# Altium project Anemoia-ESP32-SMD.PrjPcb (part 3 of 3)
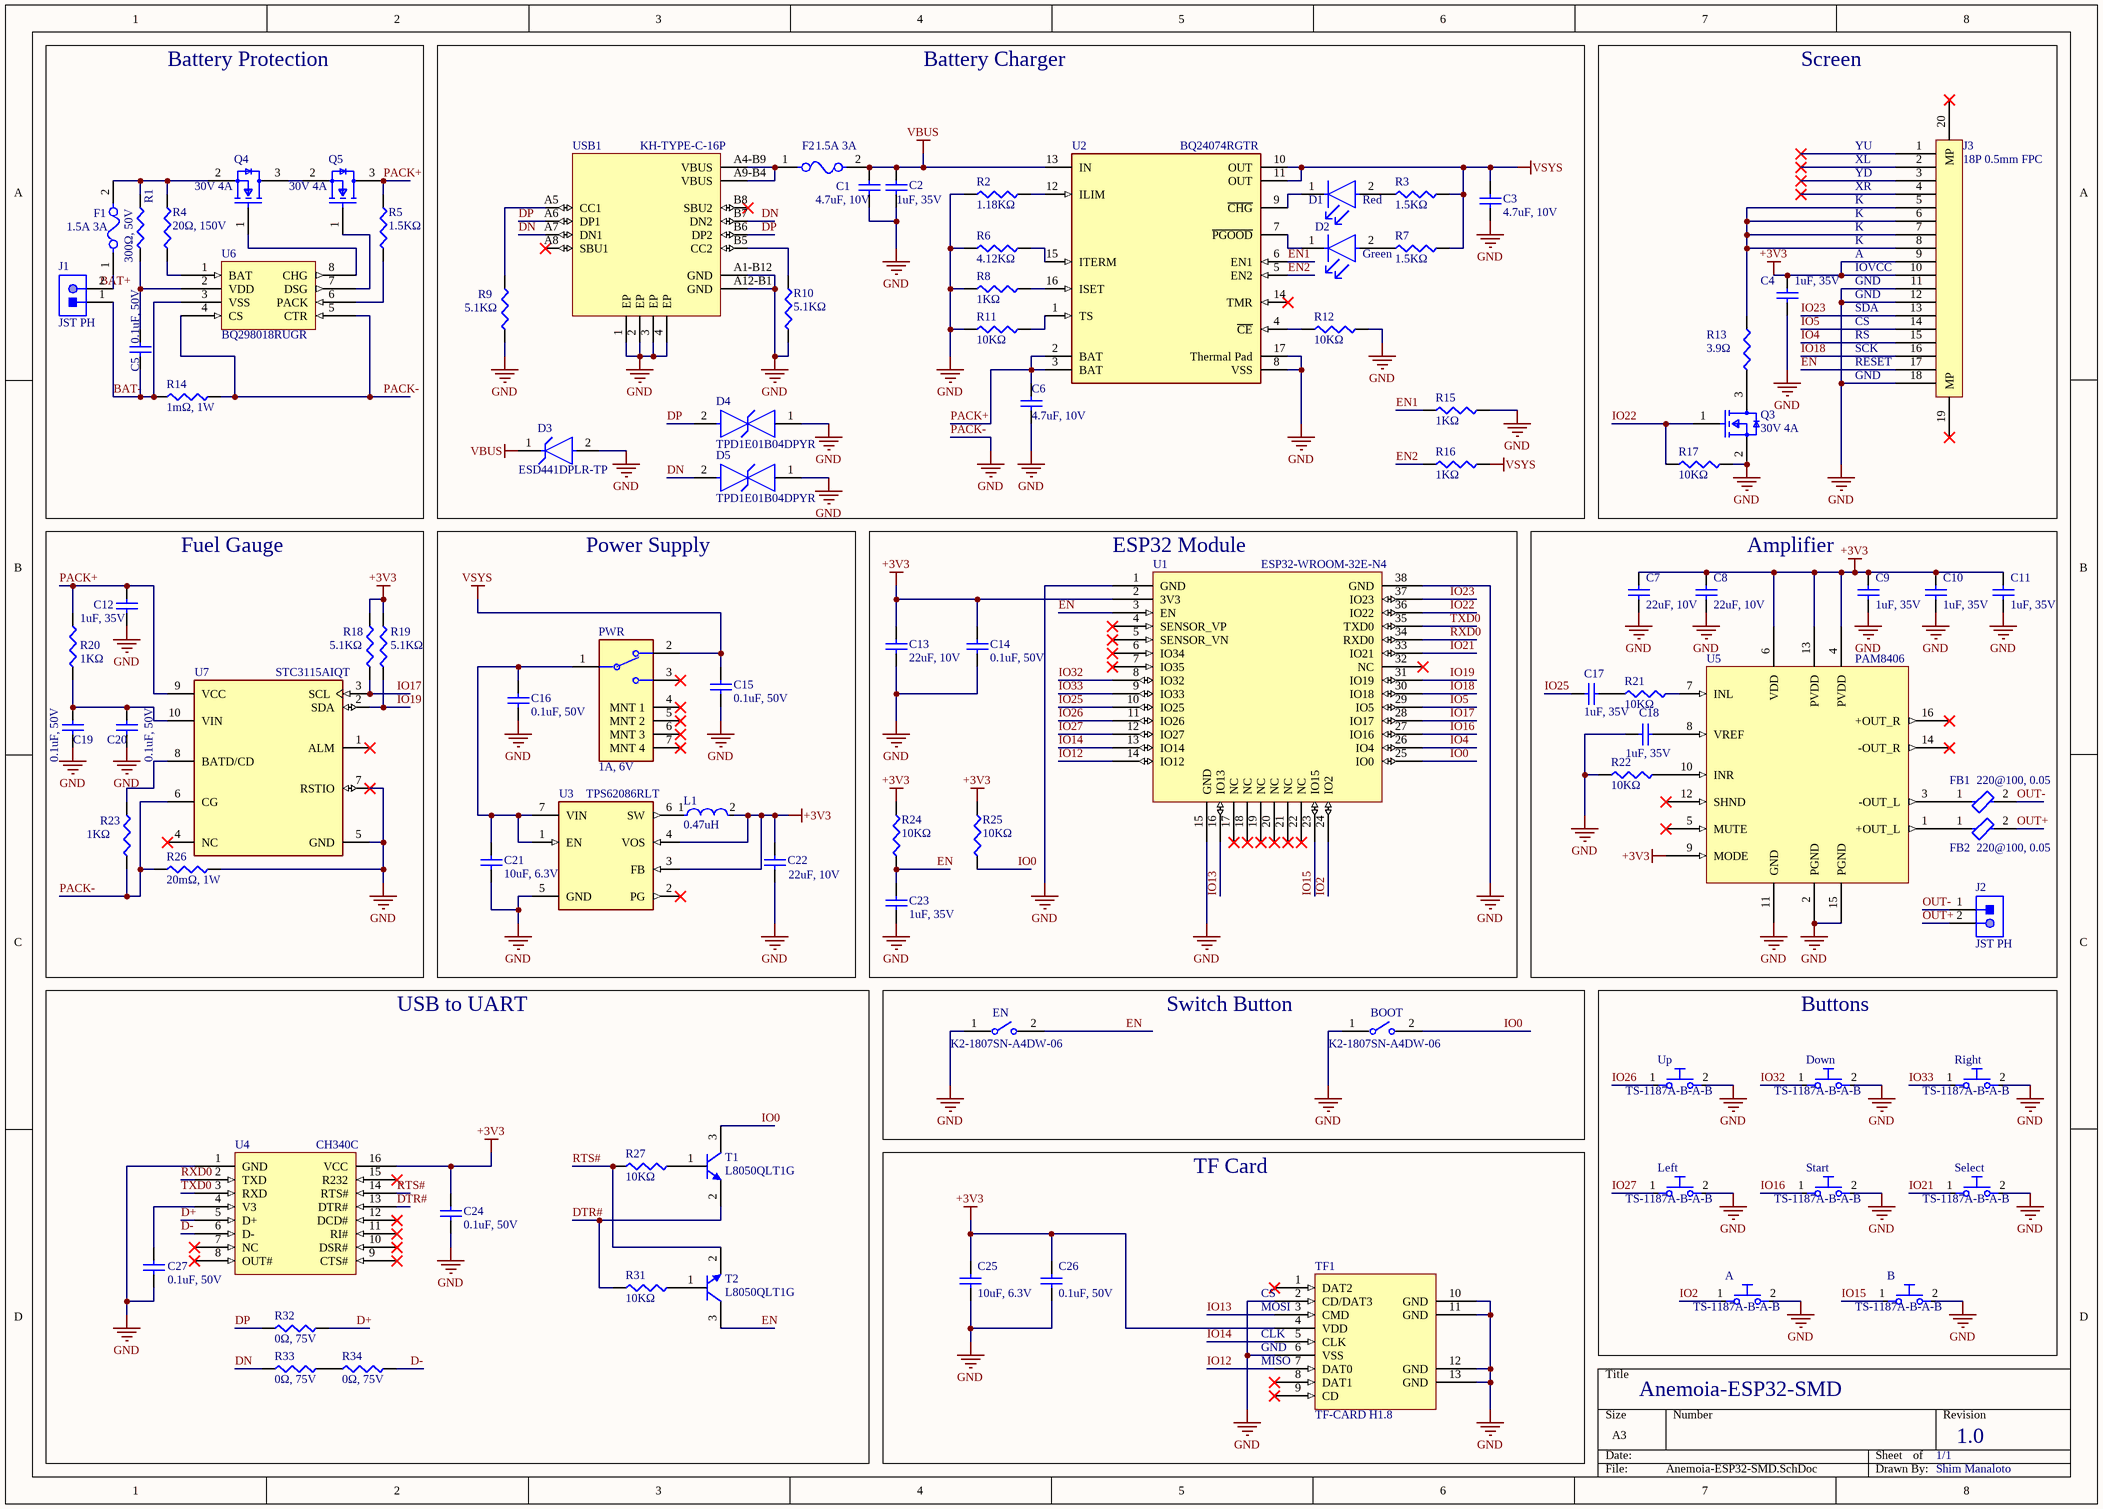
[diagram p2: Anemoia-ESP32-SMD.SchDoc]

## Sheet Anemoia-ESP32-SMD.SchDoc: Anemoia-ESP32 (continued)

### Library data of the parts (continued)
R11 R12 R17 R21 R22 R24 R25 R27 R31 = RC0402FR-0710KL: RES 10K OHM 1% 1/16W 0402; Manufacturer: Yageo Group; Power Dissipation: 62.5mW; Power Rating: 63mW; Temperature Coefficient: 100ppm/°C; Voltage Rating: 50V; Supplier 1: DigiKey; Manufacturer Part Number: RC0402FR-0710KL; RoHS: Compliant; Category: Chip SMD Resistors; Stock 1: 8175534; Case/Package: 0402; Case Code (Imperial): 0402; Case Code (Metric): 0402; China RoHS: Non-Compliant; Composition: Thick Film; Depth: 500µm; Height: 350µm; Lead Free: Lead Free; Lead Pitch: 200µm; Length: 1mm; Lifecycle Status: Production; Max Operating Temperature: 155°C; Military Standard: Not; Min Operating Temperature: -55°C; Mount: Surface Mount; Number of Pins: 2; Number of Terminals: 2; Number of Terminations: 2; Packaging: Tape & Reel; REACH SVHC: Yes; Resistance: 10kΩ; Schedule B: 8533210045, 8533210045|8533210045|8533210045|8533210045|8533210045|8533210045|8533210045|8533210045|8533210045|8533210045|8533210045|8533210045|8533210045|8533210045, 8533210045|8533210045|8533210045|8533210045|8533210045|8533210045|8533210045|8533210045|8533210045|8533210045|8533210045|8533210045|8533210045|8533210045|8533210045, 8533210045|8533210045|8533210045|8533210045|8533210045|8533210045|8533210045|8533210045|8533210045|8533210045|8533210045|8533210045|8533210045|8533210045|8533210045|8533210045; Termination: SMD/SMT; Tolerance: 1%; Voltage Rating (DC): 50V; Width: 500µm; Working Voltage: 50V; ComponentLink1URL: https://datasheet.octopart.com:443/RC0402FR-0710KL-Yageo-datasheet-175887523.pdf?src-supplier=Newark; ComponentLink1Description: https://datasheet.octopart.com:443/RC0402FR-0710KL-Yageo-datasheet-175887523.pdf?src-supplier=Newark; ComponentLink2URL: https://datasheet.octopart.com:443/RC0402FR-0710KL-Yageo-datasheet-12531192.pdf?src-supplier=Newark; ComponentLink2Description: https://datasheet.octopart.com:443/RC0402FR-0710KL-Yageo-datasheet-12531192.pdf?src-supplier=Newark; ComponentLink3URL: https://datasheet.octopart.com:443/RC0402FR-0710KL-Yageo-datasheet-8324527.pdf?src-supplier=Newark; ComponentLink3Description: https://datasheet.octopart.com:443/RC0402FR-0710KL-Yageo-datasheet-8324527.pdf?src-supplier=Newark; ComponentLink4URL: https://datasheet.octopart.com:443/RC0402FR-0710KL-Yageo-datasheet-10408619.pdf?src-supplier=element14+APAC; ComponentLink4Description: https://datasheet.octopart.com:443/RC0402FR-0710KL-Yageo-datasheet-10408619.pdf?src-supplier=element14+APAC; ComponentLink5URL: https://datasheet.octopart.com:443/RC0402FR-0710KL-Yageo-datasheet-62067350.pdf?src-supplier=element14+APAC; ComponentLink5Description: https://datasheet.octopart.com:443/RC0402FR-0710KL-Yageo-datasheet-62067350.pdf?src-supplier=element14+APAC; ComponentLink6URL: https://datasheet.octopart.com:443/RC0402FR-0710KL-Yageo-datasheet-21426659.pdf?src-supplier=element14+APAC; ComponentLink6Description: https://datasheet.octopart.com:443/RC0402FR-0710KL-Yageo-datasheet-21426659.pdf?src-supplier=element14+APAC; ComponentLink7URL: https://datasheet.octopart.com:443/RC0402FR-0710KL-Yageo-datasheet-164759695.pdf?src-supplier=Upverter; ComponentLink7Description: https://datasheet.octopart.com:443/RC0402FR-0710KL-Yageo-datasheet-164759695.pdf?src-supplier=Upverter; ComponentLink8URL: https://datasheet.octopart.com:443/RC0402FR-0710KL-Yageo-datasheet-103092701.pdf?src-supplier=Upverter; ComponentLink8Description: https://datasheet.octopart.com:443/RC0402FR-0710KL-Yageo-datasheet-103092701.pdf?src-supplier=Upverter; ComponentLink9URL: https://sigma.octopart.com:443/138820526/technical_drawing/Yageo-RC0402FR-0710KL.pdf?src-supplier=Upverter; ComponentLink9Description: https://sigma.octopart.com:443/138820526/technical_drawing/Yageo-RC0402FR-0710KL.pdf?src-supplier=Upverter; ComponentLink10URL: https://datasheet.octopart.com:443/RC0402FR-0710KL-Yageo-datasheet-98239111.pdf?src-supplier=Upverter; ComponentLink10Description: https://datasheet.octopart.com:443/RC0402FR-0710KL-Yageo-datasheet-98239111.pdf?src-supplier=Upverter; ComponentLink11URL: https://datasheet.octopart.com:443/RC0402FR-0710KL-Yageo-datasheet-68298067.pdf?src-supplier=Upverter; ComponentLink11Description: https://datasheet.octopart.com:443/RC0402FR-0710KL-Yageo-datasheet-68298067.pdf?src-supplier=Upverter; ComponentLink12URL: https://datasheet.octopart.com:443/RC0402FR-0710KL-Yageo-datasheet-68297981.pdf?src-supplier=Upverter; ComponentLink12Description: https://datasheet.octopart.com:443/RC0402FR-0710KL-Yageo-datasheet-68297981.pdf?src-supplier=Upverter; ComponentLink13URL: https://datasheet.octopart.com:443/RC0402FR-0710KL-Yageo-datasheet-141435361.pdf?src-supplier=Upverter; ComponentLink13Description: https://datasheet.octopart.com:443/RC0402FR-0710KL-Yageo-datasheet-141435361.pdf?src-supplier=Upverter; ComponentLink14URL: https://datasheet.octopart.com:443/RC0402FR-0710KL-Yageo-datasheet-12509768.pdf?src-supplier=Upverter; ComponentLink14Description: https://datasheet.octopart.com:443/RC0402FR-0710KL-Yageo-datasheet-12509768.pdf?src-supplier=Upverter; ComponentLink15URL: https://datasheet.octopart.com:443/RC0402FR-0710KL-Yageo-datasheet-8329306.pdf?src-supplier=element14; ComponentLink15Description: https://datasheet.octopart.com:443/RC0402FR-0710KL-Yageo-datasheet-8329306.pdf?src-supplier=element14; ComponentLink16URL: https://datasheet.octopart.com:443/RC0402FR-0710KL-Yageo-datasheet-505231.pdf?src-supplier=element14; ComponentLink16Description: https://datasheet.octopart.com:443/RC0402FR-0710KL-Yageo-datasheet-505231.pdf?src-supplier=element14; ComponentLink17URL: https://datasheet.octopart.com:443/RC0402FR-0710KL-Yageo-datasheet-175423674.pdf?src-supplier=SOS+electronic; ComponentLink17Description: https://datasheet.octopart.com:443/RC0402FR-0710KL-Yageo-datasheet-175423674.pdf?src-supplier=SOS+electronic; ComponentLink18URL: https://datasheet.octopart.com:443/RC0402FR-0710KL-Yageo-datasheet-137700087.pdf?src-supplier=Future+Electronics; ComponentLink18Description: https://datasheet.octopart.com:443/RC0402FR-0710KL-Yageo-datasheet-137700087.pdf?src-supplier=Future+Electronics; ComponentLink19URL: https://datasheet.octopart.com:443/RC0402FR-0710KL-Yageo-datasheet-8324255.pdf?src-supplier=Future+Electronics; ComponentLink19Description: https://datasheet.octopart.com:443/RC0402FR-0710KL-Yageo-datasheet-8324255.pdf?src-supplier=Future+Electronics; ComponentLink20URL: https://datasheet.octopart.com:443/RC0402FR-0710KL-Yageo-datasheet-79472498.pdf?src-supplier=Megastar; ComponentLink20Description: https://datasheet.octopart.com:443/RC0402FR-0710KL-Yageo-datasheet-79472498.pdf?src-supplier=Megastar; ComponentLink21URL: https://datasheet.octopart.com/RC0402FR-0710KL-Yageo-datasheet-73766026.pdf; ComponentLink21Description: https://datasheet.octopart.com/RC0402FR-0710KL-Yageo-datasheet-73766026.pdf; ComponentLink22URL: http://sigma.octopart.com:80/conflict_mineral_statement/Yageo-company-3.pdf?src-supplier=Compliance+Statements; ComponentLink22Description: http://sigma.octopart.com:80/conflict_mineral_statement/Yageo-company-3.pdf?src-supplier=Compliance+Statements; ComponentLink23URL: http://sigma.octopart.com:80/rohs_statement/Yageo-company-2.pdf?src-supplier=Compliance+Statements; ComponentLink23Description: http://sigma.octopart.com:80/rohs_statement/Yageo-company-2.pdf?src-supplier=Compliance+Statements
R13 = LTR18EZPJ3R9: RES 3.9Ω ±5% 750mW 0612; Manufacturer: ROHM; Temperature Coefficient: 200ppm/°C; Voltage Rating: 200V; Supplier 1: Mouser; Manufacturer Part Number: LTR18EZPJ3R9; RoHS: Compliant; Category: Chip SMD Resistors; Stock 1: 4914; Case/Package: 0612; Composition: Thick Film; Height: 550µm; Lifecycle Status: Production; Max Operating Temperature: 155°C; Min Operating Temperature: -55°C; Mount: Surface Mount; Number of Terminals: 2; Power Dissipation: 750mW; Power Rating: 750mW; REACH SVHC: Yes; Resistance: 3.9Ω; Tolerance: 5%; Width: 1.6mm; Working Voltage: 200V; ComponentLink1URL: https://datasheet.octopart.com:443/LTR18EZPJ3R9-ROHM-datasheet-168137580.pdf?src-supplier=IHS; ComponentLink1Description: https://datasheet.octopart.com:443/LTR18EZPJ3R9-ROHM-datasheet-168137580.pdf?src-supplier=IHS
R14 = FRM121WFR001TM: RES 1mΩ ±1% 1W 1206
R26 = FRM121WFR020TM: RES 20mΩ ±1% 1W 1206
R32-R34 = RC0603FR-070RL: RES 0Ω ±1% 100mW 0603; Manufacturer: Yageo Group; Current Rating: 1A; Temperature Coefficient: 200ppm/°C; Voltage Rating (DC): 50V; Supplier 1: Avnet; Manufacturer Part Number: RC0603FR-070RL; RoHS: Compliant; Category: Chip SMD Resistors; Stock 1: 124388; Case/Package: 0603; Case Code (Imperial): 0603; China RoHS: Non-Compliant; Composition: Thick Film; Contact Plating: Tin; Depth: 800µm; Features: Moisture Resistant; Height: 450µm; Lead Free: Lead Free; Length: 1.6mm; Lifecycle Status: Production; Max Operating Temperature: 155°C; Max Power Dissipation: 100mW; Military Standard: Not; Min Operating Temperature: -55°C; Mount: Surface Mount; Number of Pins: 2; Number of Terminals: 2; Number of Terminations: 2; Packaging: Tape & Reel; Power Dissipation: 100mW; Power Rating: 100mW; Radiation Hardening: No; REACH SVHC: Yes; Resistance: 0Ω; Schedule B: 8533210045, 8533210045|8533210045|8533210045|8533210045|8533210045; Termination: SMD/SMT; Tolerance: 1%; Voltage Rating: 75V; Width: 800µm; Working Voltage: 75V; ComponentLink1URL: https://datasheet.octopart.com:443/RC0603FR-070RL-Yageo-datasheet-127823281.pdf?src-supplier=Upverter; ComponentLink1Description: https://datasheet.octopart.com:443/RC0603FR-070RL-Yageo-datasheet-127823281.pdf?src-supplier=Upverter; ComponentLink2URL: https://datasheet.octopart.com:443/RC0603FR-070RL-Yageo-datasheet-30459151.pdf?src-supplier=IHS; ComponentLink2Description: https://datasheet.octopart.com:443/RC0603FR-070RL-Yageo-datasheet-30459151.pdf?src-supplier=IHS; ComponentLink3URL: https://datasheet.octopart.com:443/RC0603FR-070RL-Yageo-datasheet-8328172.pdf?src-supplier=element14+APAC; ComponentLink3Description: https://datasheet.octopart.com:443/RC0603FR-070RL-Yageo-datasheet-8328172.pdf?src-supplier=element14+APAC; ComponentLink4URL: https://datasheet.octopart.com:443/RC0603FR-070RL-Yageo-datasheet-34211833.pdf?src-supplier=Newark; ComponentLink4Description: https://datasheet.octopart.com:443/RC0603FR-070RL-Yageo-datasheet-34211833.pdf?src-supplier=Newark; ComponentLink5URL: https://datasheet.octopart.com:443/RC0603FR-070RL-Yageo-datasheet-164759695.pdf?src-supplier=Future+Electronics; ComponentLink5Description: https://datasheet.octopart.com:443/RC0603FR-070RL-Yageo-datasheet-164759695.pdf?src-supplier=Future+Electronics; ComponentLink6URL: https://datasheet.octopart.com:443/RC0603FR-070RL-Yageo-datasheet-137700087.pdf?src-supplier=Future+Electronics; ComponentLink6Description: https://datasheet.octopart.com:443/RC0603FR-070RL-Yageo-datasheet-137700087.pdf?src-supplier=Future+Electronics; ComponentLink7URL: https://datasheet.octopart.com:443/RC0603FR-070RL-Yageo-datasheet-15599030.pdf?src-supplier=Future+Electronics; ComponentLink7Description: https://datasheet.octopart.com:443/RC0603FR-070RL-Yageo-datasheet-15599030.pdf?src-supplier=Future+Electronics; ComponentLink8URL: https://datasheet.octopart.com:443/RC0603FR-070RL-Yageo-datasheet-12596169.pdf?src-supplier=Future+Electronics; ComponentLink8Description: https://datasheet.octopart.com:443/RC0603FR-070RL-Yageo-datasheet-12596169.pdf?src-supplier=Future+Electronics; ComponentLink9URL: https://datasheet.octopart.com/RC0603FR-070RL-Yageo-datasheet-73766026.pdf; ComponentLink9Description: https://datasheet.octopart.com/RC0603FR-070RL-Yageo-datasheet-73766026.pdf; ComponentLink10URL: http://sigma.octopart.com:80/conflict_mineral_statement/Yageo-company-3.pdf?src-supplier=Compliance+Statements; ComponentLink10Description: http://sigma.octopart.com:80/conflict_mineral_statement/Yageo-company-3.pdf?src-supplier=Compliance+Statements; ComponentLink11URL: http://sigma.octopart.com:80/rohs_statement/Yageo-company-2.pdf?src-supplier=Compliance+Statements; ComponentLink11Description: http://sigma.octopart.com:80/rohs_statement/Yageo-company-2.pdf?src-supplier=Compliance+Statements
T1 T2 = L8050QLT1G: TRANS NPN 25V 800mA SOT-23
TF1 = TF-CARD H1.8: Push-Push 1.8mm MicroSD Card (TF Card) SMD PC Card Sockets RoHS
U1 = ESP32-WROOM-32E-N4: WLAN+BT Module 2412MHz to 2484MHz 47-Pin SMD Module; Manufacturer: Espressif Systems; Max Supply Voltage: 3.6V; Min Supply Voltage: 3V; Operating Supply Voltage: 3.3V; Supplier 1: DigiKey; Manufacturer Part Number: ESP32-WROOM-32E-N4; RoHS: Compliant; Category: RF Transceiver Modules and Modems; Stock 1: 14375; Height - Seated (Max): 3.25mm; Length: 25.5mm; Max Operating Temperature: 85°C; Min Operating Temperature: -40°C; Number of Terminals: 38; Terminal Pitch: 1.27mm; Width: 18mm; ComponentLink1URL: https://datasheet.octopart.com:443/ESP32-WROOM-32E-N4-Espressif-Systems-datasheet-182247776.pdf?src-supplier=IHS; ComponentLink1Description: https://datasheet.octopart.com:443/ESP32-WROOM-32E-N4-Espressif-Systems-datasheet-182247776.pdf?src-supplier=IHS; ComponentLink2URL: https://datasheet.octopart.com:443/ESP32-WROOM-32E-N4-Espressif-Systems-datasheet-188867343.pdf?src-supplier=TME; ComponentLink2Description: https://datasheet.octopart.com:443/ESP32-WROOM-32E-N4-Espressif-Systems-datasheet-188867343.pdf?src-supplier=TME; ComponentLink3URL: https://datasheet.octopart.com:443/ESP32-WROOM-32E-N4-Espressif-Systems-datasheet-165560559.pdf?src-supplier=TME; ComponentLink3Description: https://datasheet.octopart.com:443/ESP32-WROOM-32E-N4-Espressif-Systems-datasheet-165560559.pdf?src-supplier=TME; ComponentLink4URL: https://datasheet.octopart.com:443/ESP32-WROOM-32E-N4-Espressif-Systems-datasheet-151884363.pdf?src-supplier=Future+Electronics; ComponentLink4Description: https://datasheet.octopart.com:443/ESP32-WROOM-32E-N4-Espressif-Systems-datasheet-151884363.pdf?src-supplier=Future+Electronics; Supplier Part Number 1: 1965-ESP32-WROOM-32E-N4CT-ND
U2 = BQ24074RGTR: IC BATT CHG LI-ION 1CELL 16QFN; Manufacturer: Texas Instruments; Manufacturer Lifecycle Status: ACTIVE; Battery Pack Voltage: 4.2V; Fault Protection: Over Temperature, Over Voltage, Reverse Current, Short Circuit; Interface: USB; Max Charge Current: 1.5A; Max Junction Temperature (Tj): 125°C; Max Supply Voltage: 26V; Min Input Voltage: 4.3V; Min Supply Voltage: 4.35V; Nominal Input Voltage: 10.2V; Nominal Supply Current: 1.5mA; Number of Cells: 1; Output Current: 4.5A; Output Voltage: 4.4V; Supplier 1: DigiKey; Manufacturer Part Number: BQ24074RGTR; RoHS: Compliant; Category: Battery Management; Stock 1: 11549; Case/Package: VQFN; Contact Plating: Gold; Height: 1mm; Lead Free: Lead Free; Length: 3mm; Lifecycle Status: Production; Max Operating Temperature: 85°C; Min Operating Temperature: -40°C; Number of Outputs: 1; Number of Pins: 16; Radiation Hardening: No; Schedule B: 8542390000, 8542390000|8542390000|8542390000|8542390000|8542390000; Thickness: 900µm; Weight: 22.906415mg; Width: 3mm; ComponentLink1URL: https://sigma.octopart.com:443/68310154/technical_drawing/Texas-Instruments-BQ24074RGTR.pdf?src-supplier=Texas+Instruments; ComponentLink1Description: https://sigma.octopart.com:443/68310154/technical_drawing/Texas-Instruments-BQ24074RGTR.pdf?src-supplier=Texas+Instruments; ComponentLink2URL: https://octopart.com:443/opatz8j6/c1?t=LI6ofj69sjsi_xI-KCRS32YmFkc6PT_npiBGUljbX42Z0BJJByqH_j_BDc6kYD6Eat0jCYrMh4TufOjWAhSEeoHRaPevcbfoTFbNgKFqKFSJyet90_ee_lMlYjJX60zLOSdH2MDfXXxrbeY54JkgwoMaRii8bRM8dy3Hup1_4k0sdOE1ly5WLodxihE6XQQf4-0AX14FQY1Zpi93zFashd_QXSp6UW_oM1D47aC421vpmwU9JfP_2WyTHqXyLnxVXQKU6NISI5jvI_zXQBp__czZR7PxssDrGT_L0sVVqAlxkZPKysANPn2yYv6hgsyRXqVf_F6izNr7U4_rFkcyJWP_9JNu77IKMtSnY067jtJjumLI24vxgswM5n7dL12CtrIuz8I&src-supplier=Texas+Instruments; ComponentLink2Description: https://octopart.com:443/opatz8j6/c1?t=LI6ofj69sjsi_xI-KCRS32YmFkc6PT_npiBGUljbX42Z0BJJByqH_j_BDc6kYD6Eat0jCYrMh4TufOjWAhSEeoHRaPevcbfoTFbNgKFqKFSJyet90_ee_lMlYjJX60zLOSdH2MDfXXxrbeY54JkgwoMaRii8bRM8dy3Hup1_4k0sdOE1ly5WLodxihE6XQQf4-0AX14FQY1Zpi93zFashd_QXSp6UW_oM1D47aC421vpmwU9JfP_2WyTHqXyLnxVXQKU6NISI5jvI_zXQBp__czZR7PxssDrGT_L0sVVqAlxkZPKysANPn2yYv6hgsyRXqVf_F6izNr7U4_rFkcyJWP_9JNu77IKMtSnY067jtJjumLI24vxgswM5n7dL12CtrIuz8I&src-supplier=Texas+Instruments; ComponentLink3URL: https://datasheet.octopart.com:443/BQ24074RGTR-Texas-Instruments-datasheet-38229648.pdf?src-supplier=Texas+Instruments; ComponentLink3Description: https://datasheet.octopart.com:443/BQ24074RGTR-Texas-Instruments-datasheet-38229648.pdf?src-supplier=Texas+Instruments; ComponentLink4URL: https://datasheet.octopart.com:443/BQ24074RGTR-Texas-Instruments-datasheet-37101711.pdf?src-supplier=Texas+Instruments; ComponentLink4Description: https://datasheet.octopart.com:443/BQ24074RGTR-Texas-Instruments-datasheet-37101711.pdf?src-supplier=Texas+Instruments; ComponentLink5URL: https://datasheet.octopart.com:443/BQ24074RGTR-Texas-Instruments-datasheet-21772815.pdf?src-supplier=Texas+Instruments; ComponentLink5Description: https://datasheet.octopart.com:443/BQ24074RGTR-Texas-Instruments-datasheet-21772815.pdf?src-supplier=Texas+Instruments; ComponentLink6URL: https://sigma.octopart.com:443/49250272/technical_drawing/Texas-Instruments-BQ24074RGTR.pdf?src-supplier=Texas+Instruments; ComponentLink6Description: https://sigma.octopart.com:443/49250272/technical_drawing/Texas-Instruments-BQ24074RGTR.pdf?src-supplier=Texas+Instruments; ComponentLink7URL: https://datasheet.octopart.com:443/BQ24074RGTR-Texas-Instruments-datasheet-10284113.pdf?src-supplier=Texas+Instruments; ComponentLink7Description: https://datasheet.octopart.com:443/BQ24074RGTR-Texas-Instruments-datasheet-10284113.pdf?src-supplier=Texas+Instruments; ComponentLink8URL: https://datasheet.octopart.com:443/BQ24074RGTR-Texas-Instruments-datasheet-10253851.pdf?src-supplier=Texas+Instruments; ComponentLink8Description: https://datasheet.octopart.com:443/BQ24074RGTR-Texas-Instruments-datasheet-10253851.pdf?src-supplier=Texas+Instruments; ComponentLink9URL: https://datasheet.octopart.com:443/BQ24074RGTR-Texas-Instruments-datasheet-16079513.pdf?src-supplier=Newark; ComponentLink9Description: https://datasheet.octopart.com:443/BQ24074RGTR-Texas-Instruments-datasheet-16079513.pdf?src-supplier=Newark; ComponentLink10URL: https://datasheet.octopart.com:443/BQ24074RGTR-Texas-Instruments-datasheet-165803752.pdf?src-supplier=LCSC; ComponentLink10Description: https://datasheet.octopart.com:443/BQ24074RGTR-Texas-Instruments-datasheet-165803752.pdf?src-supplier=LCSC; ComponentLink11URL: https://datasheet.octopart.com:443/BQ24074RGTR-Texas-Instruments-datasheet-163726753.pdf?src-supplier=LCSC; ComponentLink11Description: https://datasheet.octopart.com:443/BQ24074RGTR-Texas-Instruments-datasheet-163726753.pdf?src-supplier=LCSC; ComponentLink12URL: https://datasheet.octopart.com:443/BQ24074RGTR-Texas-Instruments-datasheet-164412844.pdf?src-supplier=SHENGYU+ELECTRONICS; ComponentLink12Description: https://datasheet.octopart.com:443/BQ24074RGTR-Texas-Instruments-datasheet-164412844.pdf?src-supplier=SHENGYU+ELECTRONICS; ComponentLink13URL: https://datasheet.octopart.com:443/BQ24074RGTR-Texas-Instruments-datasheet-14154534.pdf?src-supplier=iiiC; ComponentLink13Description: https://datasheet.octopart.com:443/BQ24074RGTR-Texas-Instruments-datasheet-14154534.pdf?src-supplier=iiiC; ComponentLink14URL: http://sigma.octopart.com:80/conflict_mineral_statement/Texas-Instruments-company-63.pdf?src-supplier=Compliance+Statements; ComponentLink14Description: http://sigma.octopart.com:80/conflict_mineral_statement/Texas-Instruments-company-63.pdf?src-supplier=Compliance+Statements; ComponentLink15URL: http://sigma.octopart.com:80/reach_statement/Texas-Instruments-company-64.pdf?src-supplier=Compliance+Statements; ComponentLink15Description: http://sigma.octopart.com:80/reach_statement/Texas-Instruments-company-64.pdf?src-supplier=Compliance+Statements
U3 = TPS62086RLTR: 2.4MHz Buck 3A Fixed 3.3V 1 VSON-7(2x2) Voltage Regulators - DC DC Switching Regulators RoHS; Manufacturer: Texas Instruments; Manufacturer Lifecycle Status: ACTIVE; Efficiency: 95%; Max Duty Cycle: 100%; Max Input Voltage: 6V; Max Junction Temperature (Tj): 125°C; Min Input Voltage: 2.5V; Nominal Supply Current: 17µA; Number of Outputs: 1; Output Configuration: Positive; Synchronous Rectifier: Yes; Supplier 1: DigiKey; Manufacturer Part Number: TPS62086RLTR; RoHS: Compliant; Category: Voltage Regulators - Switching; Stock 1: 149; Case/Package: VQFN; Height: 1mm; Lead Free: Lead Free; Length: 2mm; Lifecycle Status: Production; Max Operating Temperature: 125°C; Max Output Current: 3A; Max Supply Voltage: 6V; Min Operating Temperature: -40°C; Min Output Voltage: 3.3V; Min Supply Voltage: 2.5V; Mount: Surface Mount; Number of Pins: 7; Operating Supply Voltage: 6V; Output Current: 3A; Output Type: Fixed; Output Voltage: 3.3V; Packaging: Tape & Reel (TR); Radiation Hardening: No; Schedule B: 8542390000, 8542390000|8542390000|8542390000|8542390000|8542390000; Switching Frequency: 2.4MHz; Thickness: 900µm; Topology: Buck; Width: 2mm; ComponentLink1URL: https://octopart.com:443/opatz8j6/c1?t=zLf386fj0ibO5NaoSy2k8jd9nPNwEci5YYQicrbra0aFWFytLsUdbb0hTUDDaANyQQwBDYr7V3QKionmdZsJJXUYtB0NJgYjWz6oQuqaUgS5j9X-IyE01ALEJilTv_Q5C8KDVlxq14opzcnp7e_8Z4Mt-FTf3BrnMs1wWLAliJmyVZc25-BOlLyFKzDSwYyB2OqCuUck4xbtoc4mzyJqMrEioRwdgPXnEEA5Fpne0hjuF2kVbuuQmyzQeTHLPqQbzh6zJgaGUw7h6LtPvYTOUam0V6jMwSPu6xRcMnLbqQAHLiEwM3xTlXESrJQ9Z8a77dbxqkQD7BdH-9uuMFmviXkyeikfzgO4zKLpPyqxQRTxO0Tumvj-BoCeSJR17CuUm98-PX99&src-supplier=Texas+Instruments; ComponentLink1Description: https://octopart.com:443/opatz8j6/c1?t=zLf386fj0ibO5NaoSy2k8jd9nPNwEci5YYQicrbra0aFWFytLsUdbb0hTUDDaANyQQwBDYr7V3QKionmdZsJJXUYtB0NJgYjWz6oQuqaUgS5j9X-IyE01ALEJilTv_Q5C8KDVlxq14opzcnp7e_8Z4Mt-FTf3BrnMs1wWLAliJmyVZc25-BOlLyFKzDSwYyB2OqCuUck4xbtoc4mzyJqMrEioRwdgPXnEEA5Fpne0hjuF2kVbuuQmyzQeTHLPqQbzh6zJgaGUw7h6LtPvYTOUam0V6jMwSPu6xRcMnLbqQAHLiEwM3xTlXESrJQ9Z8a77dbxqkQD7BdH-9uuMFmviXkyeikfzgO4zKLpPyqxQRTxO0Tumvj-BoCeSJR17CuUm98-PX99&src-supplier=Texas+Instruments; ComponentLink2URL: https://sigma.octopart.com:443/62099402/technical_drawing/Texas-Instruments-TPS62086RLTR.pdf?src-supplier=Texas+Instruments; ComponentLink2Description: https://sigma.octopart.com:443/62099402/technical_drawing/Texas-Instruments-TPS62086RLTR.pdf?src-supplier=Texas+Instruments; ComponentLink3URL: https://datasheet.octopart.com:443/TPS62086RLTR-Texas-Instruments-datasheet-41218635.pdf?src-supplier=Texas+Instruments; ComponentLink3Description: https://datasheet.octopart.com:443/TPS62086RLTR-Texas-Instruments-datasheet-41218635.pdf?src-supplier=Texas+Instruments; ComponentLink4URL: https://sigma.octopart.com:443/49261848/technical_drawing/Texas-Instruments-TPS62086RLTR.pdf?src-supplier=Texas+Instruments; ComponentLink4Description: https://sigma.octopart.com:443/49261848/technical_drawing/Texas-Instruments-TPS62086RLTR.pdf?src-supplier=Texas+Instruments; ComponentLink5URL: https://datasheet.octopart.com:443/TPS62086RLTR-Texas-Instruments-datasheet-21096292.pdf?src-supplier=Texas+Instruments; ComponentLink5Description: https://datasheet.octopart.com:443/TPS62086RLTR-Texas-Instruments-datasheet-21096292.pdf?src-supplier=Texas+Instruments; ComponentLink6URL: https://datasheet.octopart.com:443/TPS62086RLTR-Texas-Instruments-datasheet-148807817.pdf?src-supplier=Upverter; ComponentLink6Description: https://datasheet.octopart.com:443/TPS62086RLTR-Texas-Instruments-datasheet-148807817.pdf?src-supplier=Upverter; ComponentLink7URL: https://datasheet.octopart.com:443/TPS62086RLTR-Texas-Instruments-datasheet-165804823.pdf?src-supplier=LCSC; ComponentLink7Description: https://datasheet.octopart.com:443/TPS62086RLTR-Texas-Instruments-datasheet-165804823.pdf?src-supplier=LCSC; ComponentLink8URL: https://datasheet.octopart.com:443/TPS62086RLTR-Texas-Instruments-datasheet-159118203.pdf?src-supplier=LCSC; ComponentLink8Description: https://datasheet.octopart.com:443/TPS62086RLTR-Texas-Instruments-datasheet-159118203.pdf?src-supplier=LCSC; ComponentLink9URL: https://datasheet.octopart.com:443/TPS62086RLTR-Texas-Instruments-datasheet-140571925.pdf?src-supplier=Arrow.cn; ComponentLink9Description: https://datasheet.octopart.com:443/TPS62086RLTR-Texas-Instruments-datasheet-140571925.pdf?src-supplier=Arrow.cn; ComponentLink10URL: http://sigma.octopart.com:80/conflict_mineral_statement/Texas-Instruments-company-63.pdf?src-supplier=Compliance+Statements; ComponentLink10Description: http://sigma.octopart.com:80/conflict_mineral_statement/Texas-Instruments-company-63.pdf?src-supplier=Compliance+Statements; ComponentLink11URL: http://sigma.octopart.com:80/reach_statement/Texas-Instruments-company-64.pdf?src-supplier=Compliance+Statements; ComponentLink11Description: http://sigma.octopart.com:80/reach_statement/Texas-Instruments-company-64.pdf?src-supplier=Compliance+Statements
U4 = CH340C: USB to Serial Port chip
U5 = PAM8406: 5W Stereo Audio Amplifier
U6 = BQ298018RUGR: High-side protector for single-cell li-ion and li-polymer batteries 8-X2QFN -40 to 85; Manufacturer: Texas Instruments; Manufacturer Lifecycle Status: ACTIVE; Supplier 1: DigiKey; Manufacturer Part Number: BQ298018RUGR; RoHS: Compliant; Category: Battery Management; Stock 1: 1804; Height: 400µm; Length: 1.5mm; Lifecycle Status: Production; Number of Pins: 8; Thickness: 370µm; Width: 1.5mm; ComponentLink1URL: https://octopart.com:443/opatz8j6/c1?t=T8xnCfae14IwXQKSc9tc1cECohJW915yjJ4UmEV36YlG2Lcn9JmbrueTsSySX1snmslRAmjkKezbP2FQktfpvE4FxpnhBxPkuxdhviTsLwxAqvIaIPIfA7-ivJz-FRj0uvn1B4WdmQtll-eyAmX2uKug_srjN1ursqrCW3CFz78tHDRhd8xhc5XYMdKX_d_zjXgQxuFLV-MSsMN0bUNv-iDO2U21z1yuI-xhuurlNASwlTI6GuzMI2GRxoCrYjJZgdn0XkVanL-OCxNHJv-vZ4yWy-PtCSkDUIxCOjXzuZBin09vjep-IU_Lnee7eGBGbL1QY_aCOVuu7U0jReiKM9X30uw55sJ3CJJcoHVcpW3QhWGnW2OPZWYYfkIxPRsMbP82pN8&src-supplier=Texas+Instruments; ComponentLink1Description: https://octopart.com:443/opatz8j6/c1?t=T8xnCfae14IwXQKSc9tc1cECohJW915yjJ4UmEV36YlG2Lcn9JmbrueTsSySX1snmslRAmjkKezbP2FQktfpvE4FxpnhBxPkuxdhviTsLwxAqvIaIPIfA7-ivJz-FRj0uvn1B4WdmQtll-eyAmX2uKug_srjN1ursqrCW3CFz78tHDRhd8xhc5XYMdKX_d_zjXgQxuFLV-MSsMN0bUNv-iDO2U21z1yuI-xhuurlNASwlTI6GuzMI2GRxoCrYjJZgdn0XkVanL-OCxNHJv-vZ4yWy-PtCSkDUIxCOjXzuZBin09vjep-IU_Lnee7eGBGbL1QY_aCOVuu7U0jReiKM9X30uw55sJ3CJJcoHVcpW3QhWGnW2OPZWYYfkIxPRsMbP82pN8&src-supplier=Texas+Instruments; ComponentLink2URL: https://datasheet.octopart.com:443/BQ298018RUGR-Texas-Instruments-datasheet-164413062.pdf?src-supplier=SHENGYU+ELECTRONICS; ComponentLink2Description: https://datasheet.octopart.com:443/BQ298018RUGR-Texas-Instruments-datasheet-164413062.pdf?src-supplier=SHENGYU+ELECTRONICS; ComponentLink3URL: http://sigma.octopart.com:80/conflict_mineral_statement/Texas-Instruments-company-63.pdf?src-supplier=Compliance+Statements; ComponentLink3Description: http://sigma.octopart.com:80/conflict_mineral_statement/Texas-Instruments-company-63.pdf?src-supplier=Compliance+Statements; ComponentLink4URL: http://sigma.octopart.com:80/reach_statement/Texas-Instruments-company-64.pdf?src-supplier=Compliance+Statements; ComponentLink4Description: http://sigma.octopart.com:80/reach_statement/Texas-Instruments-company-64.pdf?src-supplier=Compliance+Statements
U7 = STC3115AIQT: Battery Fuel Gauge, Li-Ion, Li-Pol, 2.7V to 4.2V Supply, I2C Interface, DFN-10; Manufacturer: STMicroelectronics; Max Junction Temperature (Tj): 150°C; Max Supply Voltage: 4.5V; Nominal Supply Current: 45µA; Number of Cells: 1; Operating Supply Voltage: 3.6V; Supplier 1: DigiKey; Manufacturer Part Number: STC3115AIQT; RoHS: Compliant; Category: Battery Management; Stock 1: 3658; Ambient Temperature Range High: 85°C; Case/Package: DFN; China RoHS: Compliant; Height: 600µm; Height - Seated (Max): 600µm; Interface: I2C; Lead Free: Lead Free; Length: 3mm; Lifecycle Status: Production; Max Operating Temperature: 85°C; Min Operating Temperature: -40°C; Min Supply Voltage: 2.7V; Mount: Surface Mount; Number of Channels: 1; Number of Circuits: 1; Number of Outputs: 1; Number of Pins: 10; Number of Terminals: 10; Operating Supply Current: 45µA; Output Voltage: 4.2V; REACH SVHC: Yes; Schedule B: 8542390000, 8542390000|8542390000|8542390000|8542390000|8542390000|8542390000|8542390000|8542390000|8542390000|8542390000|8542390000|8542390000|8542390000|8542390000|8542390000|8542390000|8542390000|8542390000|8542390000|8542390000|8542390000|8542390000|8542390000|85; Terminal Pitch: 500µm; Weight: 50.008559mg; Width: 2mm; ComponentLink1URL: https://datasheet.octopart.com:443/STC3115AIQT-STMicroelectronics-datasheet-62335364.pdf?src-supplier=SHENGYU+ELECTRONICS; ComponentLink1Description: https://datasheet.octopart.com:443/STC3115AIQT-STMicroelectronics-datasheet-62335364.pdf?src-supplier=SHENGYU+ELECTRONICS; ComponentLink2URL: https://datasheet.octopart.com:443/STC3115AIQT-STMicroelectronics-datasheet-16348456.pdf?src-supplier=Future+Electronics; ComponentLink2Description: https://datasheet.octopart.com:443/STC3115AIQT-STMicroelectronics-datasheet-16348456.pdf?src-supplier=Future+Electronics
USB1 = KH-TYPE-C-16P: CONN RCPT Type-C 16POS SMD R/A